# EasyEDA Pro project ProPrj_HydroNodeStation01_2026-04-23.epro, board PCB1
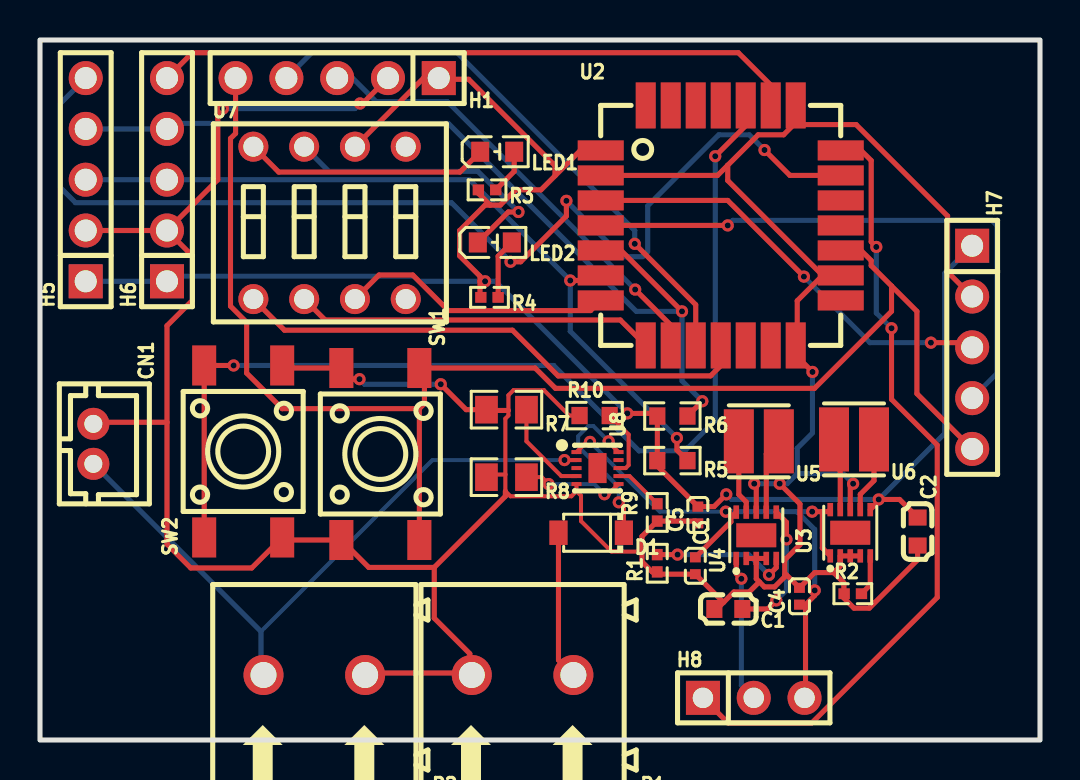
[diagram p4: board, top side]
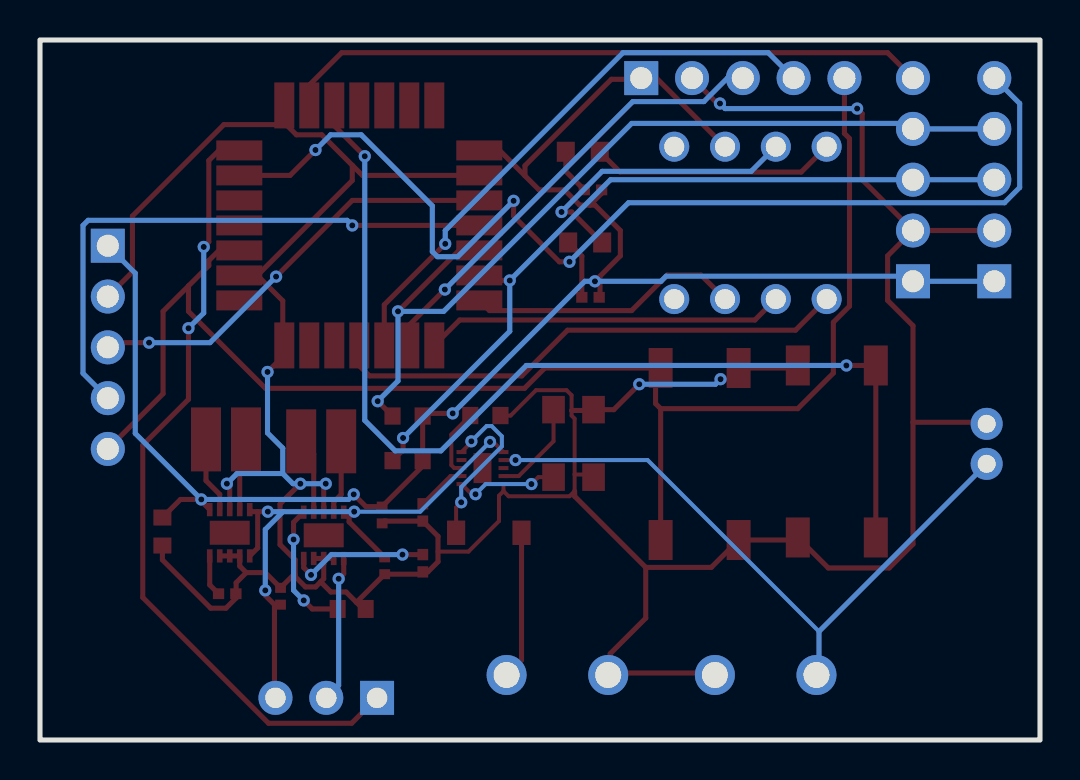
[diagram p5: board, bottom side, seen from below]

Outline 50 x 35 mm; copper layers: Top Layer, Bottom Layer. Coordinates in mm from the lower left corner of the outline.
Outline path: rectangle 0,35 50,0
Stack: Top Layer 0.035mm / Dielectric1 1.51mm FR4 er 4.5 / Bottom Layer 0.035mm

## Design rules (mm)
template: JLCPCB Capability(Two Layers Board)
spacing copperThickness1oz (default): track to track 0.102, other pairs 0.152 to 0.3
spacing copperThickness2oz: track to track 0.203, other pairs 0.152 to 0.3
track width copperThickness1oz (default): min 0.127, default 0.254, max 2.54
track width copperThickness2oz: min 0.203, default 0.254, max 2.54
differential pair differentialPair (default): width min 0.127, default 0.254, max 2.54; gap min 0.152, default 0.152
via viaSize (default): diameter min 0.5, default 0.61, max 10; hole min 0.3, default 0.305, max 6.3

## Placement (name value [footprint] x y rotation side)
C1  22uF  [C0603]  34.42 6.55 180 top
C2  22uF  [C0603]  43.88 10.42 270 top
C3  10uF  [C0402]  32.77 8.71 270 top
C4  10uF  [C0402]  37.97 7.19 90 top
C5  10uF  [C0402]  32.89 11.25 90 top
CN1  B2B-PH-K-S(LF)(SN)  [CONN-TH_B2B-PH-K-S]  2.67 14.81 270 top
D1  MBRX120LF-TP  [SOD-123_L2.7-W1.6-LS3.7-RD]  27.56 10.36 180 top
H1  PZ254V-11-05P  [HDR-TH_5P-P2.54-V-M]  14.86 33.09 180 top
H5  PZ254V-11-05P  [HDR-TH_5P-P2.54-V-M]  2.29 28.02 90 top
H6  PZ254V-11-05P  [HDR-TH_5P-P2.54-V-M]  6.35 28.02 90 top
H7  PZ254V-11-05P  [HDR-TH_5P-P2.54-V-M]  46.61 19.63 270 top
H8  PZ254V-11-03P  [HDR-TH_3P-P2.54-V-M_PZ254V-11-03P]  35.69 2.11 0 top
LED1  YLED0603R  [LED0603-FD]  22.86 29.41 180 top
LED2  YLED0603R  [LED0603-FD]  22.74 24.88 180 top
P1  WJ500V-5.08-2P  [CONN-TH_2P-P5.00_WJ500V-5.08-2P]  24.13 3.25 180 top
P2  WJ500V-5.08-2P  [CONN-TH_2P-P5.00_WJ500V-5.08-2P]  13.72 3.25 180 top
R1  36.5kΩ  [R0402]  30.86 8.84 90 top
R2  16.2kΩ  [R0402]  40.64 7.31 0 top
R3  1kΩ  [R0402]  22.35 27.51 180 top
R4  1kΩ  [R0402]  22.47 22.13 180 top
R5  4.7kΩ  [R0603]  31.62 13.97 180 top
R6  4.7kΩ  [R0603]  31.62 16.2 180 top
R7  10kΩ  [R0805]  23.32 16.52 180 top
R8  10kΩ  [R0805]  23.32 13.14 180 top
R9  12kΩ  [R0402]  30.86 11.38 90 top
R10  300Ω  [R0603]  27.73 16.22 0 top
SW1  TS-1095PS-A1B2-C3D2  [KEY-SMD_4P-L6.0-W6.0-P3.90-LS9.0]  17.02 14.3 270 top
SW2  TS-1095PS-A1B2-C3D2  [KEY-SMD_4P-L6.0-W6.0-P3.90-LS9.0]  10.16 14.43 90 top
U2  Wio-E5  [COMM-SMD_L12.0-W12.0-P1.25_114993120]  34.04 25.73 0 top
U3  TPS63900DSKR  [WSON-10_L2.5-W2.5-W0.50-TL-EP]  40.51 10.36 90 top
U4  TPS63900DSKR  [WSON-10_L2.5-W2.5-W0.50-TL-EP]  35.81 10.23 90 top
U5  2.2uH  [IND-SMD_L3.0-W3.0_LVF303012-4R7M-N]  35.94 14.93 180 top
U6  2.2uH  [IND-SMD_L3.0-W3.0_LVF303012-4R7M-N]  40.7 15.03 180 top
U7  SMQS-04R-TP  [SW-TH_8P-P2.54_SMQS-04R-TP]  14.48 25.86 0 top
U8  BQ25185DLHR  [WSON-10_L2.2-W2.0-P0.40-BL-EP_TI_DLH0010A]  27.88 13.6 270 top

## Footprints (pads in the part's own frame, mm; a bottom-side part is the same pattern mirrored in y, then rotated)
C0402
  rect 0.5x0.54 smd: 1(-0.42,0) 2(0.42,0)
C0603
  rect 0.8x0.9 smd: 1(-0.7,0) 2(0.7,0)
COMM-SMD_L12.0-W12.0-P1.25_114993120
  rect 2.3x1 smd: 1(-6,3.75) 2(-6,2.5) 3(-6,1.25) 4(-6,0) 5(-6,-1.25) 6(-6,-2.5) 7(-6,-3.75) 15(6,-3.75) 16(6,-2.5) 17(6,-1.25) 18(6,0) 19(6,1.25) 20(6,2.5) 21(6,3.75)
  rect 1x2.3 smd: 8(-3.75,-6) 9(-2.5,-6) 10(-1.25,-6) 11(0,-6) 12(1.25,-6) 13(2.5,-6) 14(3.75,-6) 22(3.75,6) 23(2.5,6) 24(1.25,6) 25(0,6) 26(-1.25,6) 27(-2.5,6) 28(-3.75,6)
CONN-TH_2P-P5.00_WJ500V-5.08-2P
  round 2 hole 1.3: 1(-2.54,0) 2(2.54,0)
CONN-TH_B2B-PH-K-S
  round 1.6 hole 0.9: 1(1,0) 2(-1,0)
HDR-TH_3P-P2.54-V-M_PZ254V-11-03P
  rect 1.7x1.7 hole 1.02: 1(-2.54,0)
  round 1.7 hole 1.02: 2(0,0) 3(2.54,0)
HDR-TH_5P-P2.54-V-M
  rect 1.7x1.7 hole 1.1: 1(-5.08,0)
  round 1.7 hole 1.1: 2(-2.54,0) 3(0,0) 4(2.54,0) 5(5.08,0)
IND-SMD_L3.0-W3.0_LVF303012-4R7M-N
  rect 1.5x3.2 smd: 1(-1,0) 2(1,0)
KEY-SMD_4P-L6.0-W6.0-P3.90-LS9.0
  rect 2x1.2 smd: 1(-4.3,1.95) 2(4.3,1.95) 3(-4.3,-1.95) 4(4.3,-1.95)
LED0603-FD
  rect 0.9x1 smd: 1(-0.85,0) 2(0.85,0)
R0402
  rect 0.566x0.54 smd: 1(-0.433,0) 2(0.433,0)
R0603
  rect 0.806x0.864 smd: 1(-0.753,0) 2(0.753,0)
R0805
  rect 1.133x1.377 smd: 1(-1,0) 2(1,0)
SOD-123_L2.7-W1.6-LS3.7-RD
  rect 0.91x1.22 smd: 1(-1.635,0) 2(1.635,0)
SW-TH_8P-P2.54_SMQS-04R-TP
  round 1.5 hole 1: 1(-3.81,-3.81) 2(-1.27,-3.81) 3(1.27,-3.81) 4(3.81,-3.81) 5(3.81,3.81) 6(1.27,3.81) 7(-1.27,3.81) 8(-3.81,3.81)
WSON-10_L2.2-W2.0-P0.40-BL-EP_TI_DLH0010A
  rect 0.2x0.5 smd: 1(-0.8,-1.05) 2(-0.4,-1.05) 3(0,-1.05) 4(0.4,-1.05) 5(0.8,-1.05) 6(0.8,1.05) 7(0.4,1.05) 8(0,1.05) 9(-0.4,1.05) 10(-0.8,1.05)
  rect 1.5x0.9 smd: 11(0,0)
WSON-10_L2.5-W2.5-W0.50-TL-EP
  rect 0.665x0.28 smd: 1(-1.157,1) 2(-1.157,0.5) 3(-1.157,0) 4(-1.157,-0.5) 5(-1.157,-1) 6(1.157,-1) 7(1.157,-0.5) 8(1.157,0) 9(1.157,0.5) 10(1.157,1)
  rect 1.2x2 smd: 11(0,0)

## Nets
As in the schematic.

Pads without a net: U2 12 13 15 18 19 25 26 27 28; U3 11; U4 11; U7 4 5; U8 3 9 11

## Via types
v1: diameter 0.61, hole 0.305, Top Layer to Bottom Layer, 43 vias

## Routing (per net, layer and track width the routed paths; a pad name or vN(x,y) marks a point on that pad's centre or on a via; arc(x,y) is an arc through that point)
+5V: length 6.7
  Top Layer w0.254: v1(36.81,6.98) 36.39,6.55 C1.1 ; v1(37.32,10.03) 37.32,10.88 U4.6
  Bottom Layer w0.254: v1(37.32,10.03) 37.32,7.49 v1(36.81,6.98)
GND: length 191.2
  Top Layer w0.2: 23.27,13.27 23.27,12.44 23.52,12.19 26.57,12.19 26.82,12.44 ; 23.27,13.27 23.27,16.07 23.42,16.22 23.42,17.24 23.68,17.49 25.2,17.49 26.47,16.22 R10.1 ; 23.27,13.27 22.46,13.27 R8.2 ; 26.82,12.44 27.05,12.21 27.05,10.94 28.57,9.42 30.1,9.42 ; 26.82,12.44 U8.5
  Top Layer w0.254: 23.27,12.44 23.27,12.19 19.71,8.63 ; v1(15.97,18.04) 15.63,18.04 SW1.3 12.24,18.6 SW2.4 ; U2.2 33.88,28.23 34.39,28.74 ; 37.69,30.77 37.18,30.26 35.91,30.26 34.39,28.74 ; 37.69,30.77 37.69,31.63 U2.22 ; 37.69,30.77 40.81,30.77 45.38,26.2 45.38,23.4 H7.2 ; 37.24,8.24 37.24,9 38,9.77 38,11.8 v1(36.98,12.81) ; 37.24,8.24 37.34,8.24 C4.2 38.74,8.37 39.69,8.37 ; 37.24,8.24 37.24,8.16 36.73,7.66 36.22,7.66 35.97,7.91 ; 39.13,23.23 U2.16 ; 39.13,23.23 34.39,27.97 34.39,28.74 ; 39.13,23.23 37.86,21.96 37.86,19.8 ; U3.8 40.51,12.67 v1(40.66,12.81) ; 39.69,8.37 40.01,8.7 U3.2 U3.3 U3.4 ; 39.69,8.37 40.19,7.86 40.19,7.35 ; 21.49,3.35 P1.2 ; 21.49,3.35 21.49,4.31 19.71,6.09 19.71,8.63 ; 21.49,3.35 16.35,3.35 P2.1 ; U4.3 35.81,8.06 35.97,7.91 ; U4.3 U4.4 ; U4.3 U4.2 ; H1.2 16.13,31.82 v1(16,31.82) ; v1(35.71,12.81) 35.81,12.71 U4.8 ; 37.86,19.8 37.86,19.16 v1(38.62,18.4) ; 37.86,19.8 U2.14 ; H6.2 8.89,28.02 8.89,31.32 v1(9.14,31.57) ; H6.2 7.62,24.2 7.62,21.98 6.35,20.71 6.35,15.89 ; H6.2 H5.2 ; 34.19,6.89 34.7,7.4 35.46,7.4 35.97,7.91 ; 34.19,6.89 34.16,6.89 C3.2 30.98,8.29 R1.1 30.61,8.41 30.1,8.91 30.1,10.18 R9.1 32.78,10.94 C5.1 ; 34.19,6.89 33.85,6.55 C1.2 ; 19.71,8.63 16.44,8.63 SW1.4 12.24,10 SW2.3 10.59,8.6 7.54,8.6 6.35,9.79 6.35,15.89 ; C2.2 43.88,9.01 41.46,6.59 40.7,6.59 40.19,7.1 40.19,7.35 ; 40.19,7.35 R2.1 ; 6.35,15.89 2.75,15.89 CN1.2 ; 23.42,16.48 22.37,16.48 R7.2 21.31,16.52 v1(20.04,17.79)
  Bottom Layer w0.254: 37.86,13.32 37.35,12.81 v1(36.98,12.81) v1(35.71,12.81) ; 37.86,13.32 40.15,13.32 v1(40.66,12.81) ; 37.86,13.32 37.86,14.59 38.62,15.35 v1(38.62,18.4) ; v1(20.04,17.79) 16.23,17.79 v1(15.97,18.04) ; v1(9.14,31.57) 15.75,31.57 v1(16,31.82)
VCC: length 91.5
  Top Layer w0.254: R4.2 22,22.18 22,22.94 ; U3.6 41.93,11.94 v1(41.93,12.03) 42.98,12.03 C2.1 ; v1(34.31,12.28) 33.7,11.67 C5.2 30.87,13.7 R5.2 R6.2 30.73,16.33 v1(29.37,16.33) ; 25.75,28.21 25.05,27.51 23.78,27.51 23.02,26.74 22.51,26.74 ; 25.75,28.21 25.75,28.72 21.43,33.03 20,33.03 H1.1 19.18,33.09 U7.6 ; 25.75,28.21 27.02,29.48 U2.1 ; 22.51,26.74 22.25,26.74 20.98,25.47 20.98,24.2 22,23.19 22,22.94 ; 22.51,26.74 21.92,27.33 R3.2 ; 22,22.94 v1(22.25,22.94)
  Bottom Layer w0.254: H5.1 H6.1 6.6,23.19 18.7,23.19 18.95,22.94 v1(22.25,22.94) 22.76,22.94 v1(29.37,16.33) ; v1(34.31,12.28) 34.57,12.03 v1(41.93,12.03) 45.24,15.33 45.24,23.34 H7.1
BOOT: length 52.9
  Top Layer w0.254: SW2.1 SW2.2 v1(9.68,18.73) ; v1(33.76,29.19) 35.29,30.71 U2.24
  Bottom Layer w0.254: v1(33.76,29.19) 33.76,15.98 32.24,14.46 29.95,14.46 25.68,18.73 v1(9.68,18.73)
CLK: length 29.2
  Top Layer w0.254: U2.4 v1(34.39,25.73)
  Bottom Layer w0.254: v1(34.39,25.73) 34.64,25.98 47.59,25.98 47.85,25.73 47.85,18.33 H7.4
DIO: length 21.6
  Top Layer w0.254: H7.3 46.38,19.87 v1(44.55,19.87) ; v1(38.2,23.17) 34.39,26.98 U2.3
  Bottom Layer w0.254: v1(38.2,23.17) 41.5,19.87 v1(44.55,19.87)
EN5V: length 39.8
  Top Layer w0.254: v1(42.58,20.59) 42.58,17.03 44.86,14.75 44.86,7.13 38.57,0.84 34.42,0.84 H8.1 ; v1(41.81,24.65) 41.56,24.91 41.56,28.97 41.05,29.48 U2.21
  Bottom Layer w0.254: v1(42.58,20.59) 41.81,21.35 v1(41.81,24.65)
LED1: length 12.3
  Top Layer w0.254: LED1.2 20.99,28.4 11.94,28.4 U7.8
LED2: length 14.7
  Top Layer w0.254: LED2.2 23.42,26.4 v1(23.92,26.4)
  Bottom Layer w0.254: v1(23.92,26.4) 21.89,28.43 14.44,28.43 U7.7
LIPOPLUS: length 30.4
  Top Layer w0.2: v1(27.5,14.9) 27.33,14.9 U8.1
  Top Layer w0.254: C3.1 34.54,10.91 34.54,11.16 ; v1(38.74,7.48) 38.74,7.23 38.28,6.77 ; H8.3 38.28,2.16 38.28,6.77 ; 34.54,11.16 34.58,11.16 U4.10 ; 34.54,11.16 v1(34.29,11.42) ; v1(38.61,11.42) 39.12,11.42 ; 39.12,11.42 39.12,9.6 U3.1 ; 39.12,11.42 39.41,11.42 U3.10 ; 38.28,6.77 C4.1
  Bottom Layer w0.2: v1(34.29,11.42) 30.99,11.42 v1(27.5,14.9)
  Bottom Layer w0.254: 37.85,11.42 v1(38.61,11.42) ; 37.85,11.42 v1(34.29,11.42) ; 37.85,11.42 38.74,10.53 v1(38.74,7.48)
PA0: length 32.4
  Top Layer w0.254: H6.5 7.62,34.36 34.92,34.36 36.54,32.74 U2.23
PB3: length 18
  Top Layer w0.254: U7.2 14.25,21 29.02,21 U2.8
PB4: length 13.7
  Top Layer w0.254: U2.7 27.53,21.47 20.42,21.47 18.64,23.25 16.95,23.25 U7.3
PB5: length 26.2
  Top Layer w0.254: U2.11 34.04,18.71 33.53,18.2 25.91,18.2 23.62,20.49 12.22,20.49 U7.1
PB10: length 54.1
  Top Layer w0.254: v1(36.23,29.5) 37.5,28.23 U2.20 ; v1(26.32,26.96) 26.32,26.2 24.03,23.91 v1(23.53,23.91)
  Bottom Layer w0.254: v1(36.23,29.5) 35.46,30.26 33.94,30.26 30.38,26.7 30.38,24.42 30.13,24.16 29.11,24.16 v1(26.32,26.96) ; H5.5 1.02,31.82 1.02,27.62 1.78,26.86 20.57,26.86 v1(23.53,23.91)
RST: length 73.5
  Top Layer w0.254: 18.97,16.57 SW1.2 ; 18.97,16.57 19.22,16.82 19.22,18.34 SW1.1 24.76,18.6 25.77,17.58 38.73,17.58 42.58,21.43 42.58,22.7 ; 18.97,16.57 12.11,16.57 10.33,18.34 10.33,20.88 9.53,21.69 9.53,30.07 9.78,30.33 H1.5 ; U2.17 41.05,24.48 41.56,23.97 41.56,23.72 42.58,22.7 ; 42.58,22.7 43.85,21.43 43.85,17.32 H7.5
RX: length 22.8
  Top Layer w0.254: v1(29.76,22.52) 31.54,20.74 U2.9
  Bottom Layer w0.254: v1(29.76,22.52) 20.36,31.92 16.8,31.92 15.63,33.09 H1.3
SCL: length 45.1
  Top Layer w0.254: v1(33.12,16.94) R6.1 ; v1(32.1,21.43) 29.05,24.48 U2.5
  Bottom Layer w0.254: v1(33.12,16.94) 32.1,17.96 v1(32.1,21.43) 29.81,21.43 20.42,30.83 6.62,30.83 H6.4 H5.4
SDA: length 39.4
  Top Layer w0.254: U2.6 27.78,22.97 v1(26.51,22.97) ; v1(31.85,15.1) 31.85,14.5 R5.1
  Bottom Layer w0.254: H5.3 H6.3 21.47,28.02 v1(26.51,22.97) 26.51,20.44 v1(31.85,15.1)
TX: length 28.6
  Top Layer w0.254: v1(29.74,24.81) 32.79,21.76 U2.10
  Bottom Layer w0.254: v1(29.74,24.81) 29.74,25.47 20.85,34.36 13.59,34.36 H1.4
$1N3315: length 3.8
  Top Layer w0.254: U6.1 41.7,12.97 41.01,12.28 U3.7
$1N3324: length 3.6
  Top Layer w0.254: U6.2 40.01,14.71 U3.9
$1N3329: length 3.7
  Top Layer w0.254: U5.2 34.94,12.27 35.31,11.9 U4.9
$1N3333: length 3.8
  Top Layer w0.254: U5.1 36.31,14.31 U4.7
$1N3893: length 7
  Top Layer w0.254: v1(36.45,8.25) 36.81,8.62 U4.5 ; R1.2 v1(31.88,9.27)
  Bottom Layer w0.254: v1(31.88,9.27) 35.43,9.27 v1(36.45,8.25)
$1N3996: length 2.1
  Top Layer w0.254: R2.2 41.51,7.75 U3.5
$1N4260: length 7.3
  Top Layer w0.254: U4.1 34.81,8.32 v1(35.07,8.06)
  Bottom Layer w0.254: H8.2 35.07,2.73 v1(35.07,8.06)
$1N5487: length 2.3
  Top Layer w0.254: LED1.1 23.71,28.43 R3.1
$1N5489: length 3
  Top Layer w0.254: LED2.1 22.91,24.19 R4.1
$1N6354: length 33.4
  Top Layer w0.2: v1(26.22,14) U8.2
  Bottom Layer w0.2: 11.05,5.42 19.62,14 v1(26.22,14)
  Bottom Layer w0.254: P2.2 11.05,3.38 11.05,5.42 CN1.1
$1N6531: length 4.8
  Top Layer w0.2: U8.4 26.06,13.2 24.32,14.94 R7.1
$1N6619: length 8.6
  Top Layer w0.2: v1(28.94,11.89) 29.19,11.63 D1.1 ; v1(28.43,14.93) 28.43,14.89 U8.10
  Bottom Layer w0.2: v1(28.43,14.93) 27.67,15.7 27.42,15.7 26.91,15.19 26.91,14.68 28.94,12.65 v1(28.94,11.89)
$1N6623: length 7.4
  Top Layer w0.254: D1.2 25.92,4 P1.1
$1N6664: length 5.2
  Top Layer w0.2: R8.1 25.08,13.14 v1(25.43,12.8) ; U8.6 28.42,12.29 v1(28.22,12.29)
  Bottom Layer w0.2: v1(28.22,12.29) 27.72,12.8 v1(25.43,12.8)
$1N6768: length 2.5
  Top Layer w0.2: R9.2 29.48,13.2 U8.7
$1N6858: length 3.4
  Top Layer w0.2: U8.8 29.29,13.6 29.43,13.74 29.43,15.27 R10.2
